# Altium project Air724UG_Reference Design_V1.0(PADS9.5).PrjPcb (part 3 of 3)

## Sheet USB.SchDoc: Air724UG 参考设计
size 594 x 419 mm; DESIGNER: Loukanghua; REV: V1.0
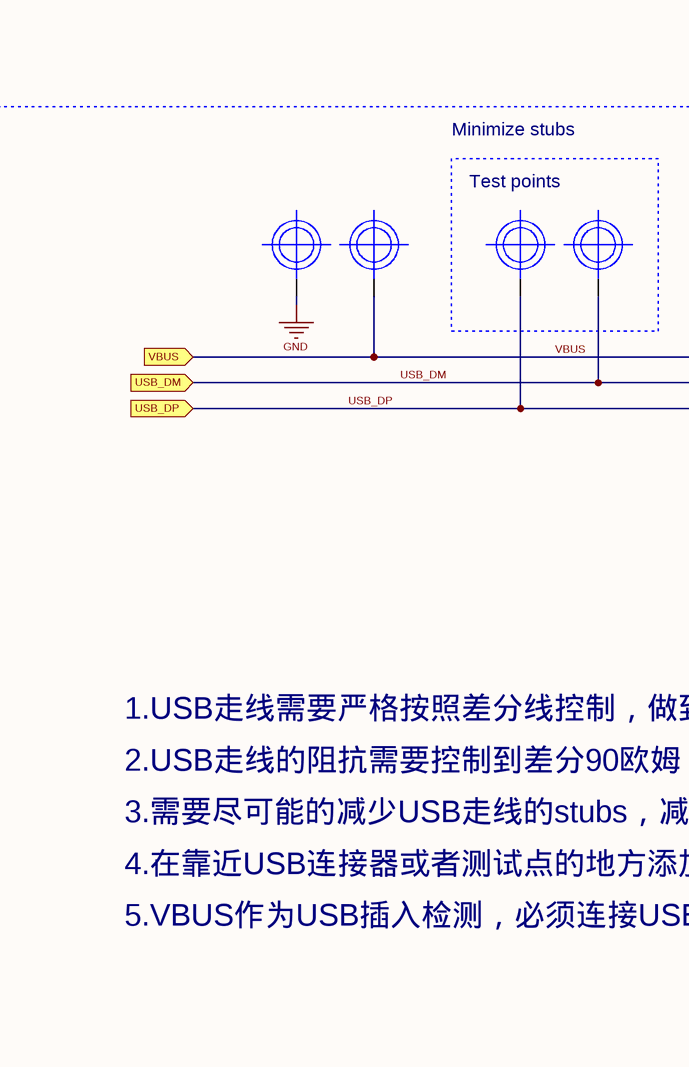
[diagram p42: USB.SchDoc, top left]
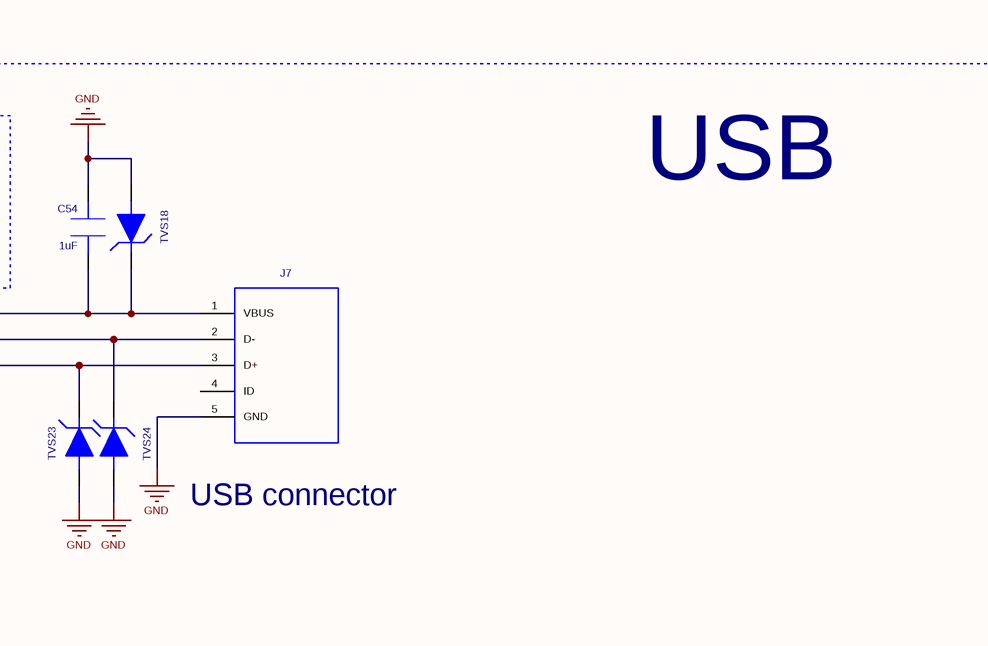
[diagram p43: USB.SchDoc, top middle]
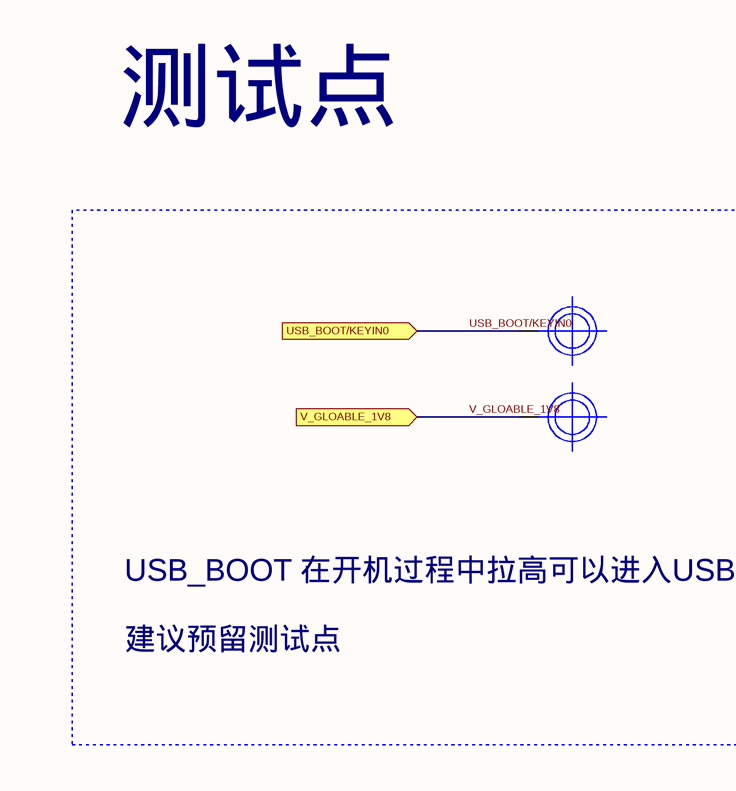
[diagram p44: USB.SchDoc, bottom left]
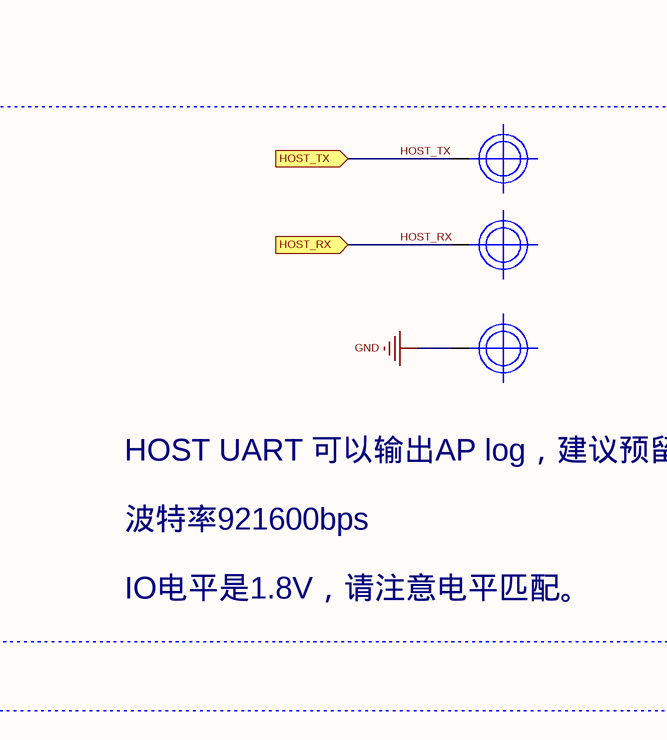
[diagram p45: USB.SchDoc, bottom middle]
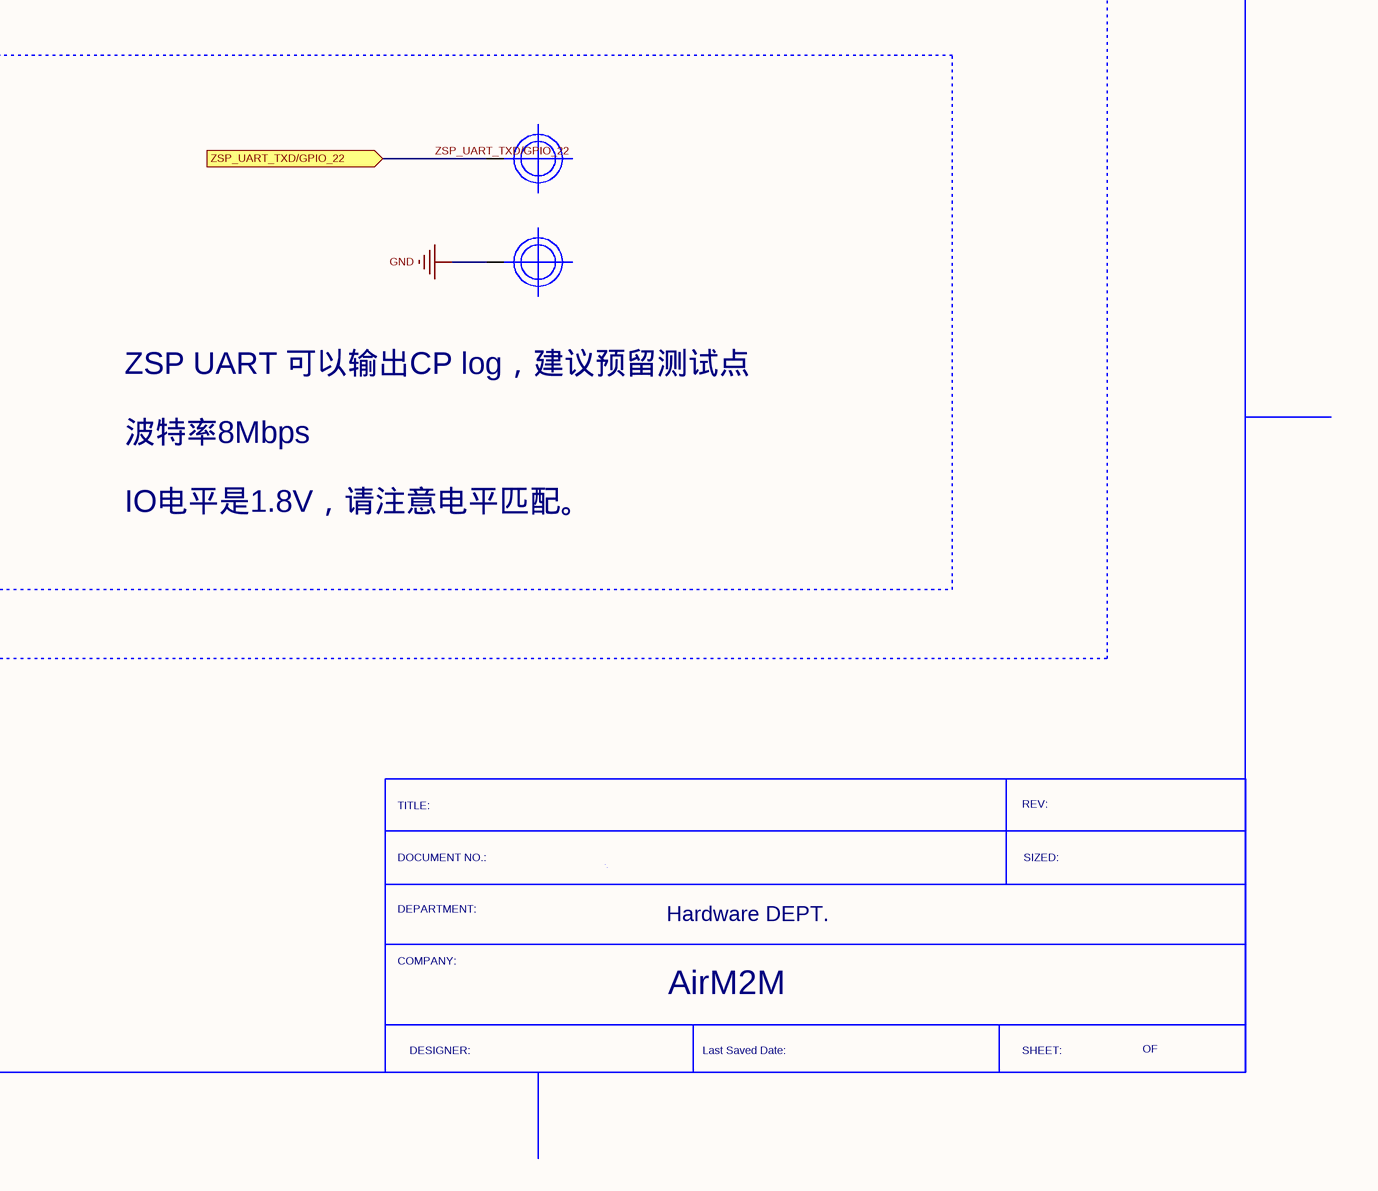
[diagram p46: USB.SchDoc, bottom right]

### Parts
C54  value 1uF  [SC0402]  (hidden comment: CAP-1000PF-0402-X7R)
J7  USB-MICRO-10305060GSAR001  [USB90DEGREE]  (value not drawn)
T1  TESTPOINT  [TP1_5]  (value not drawn)
T2  TESTPOINT  [TP1_5]  (value not drawn)
T3  TESTPOINT  [TP1_5]  (value not drawn)
T4  TESTPOINT  [TP1_5]  (value not drawn)
T5  TESTPOINT  [TP1_5]  (value not drawn)
T6  TESTPOINT  [TP1_5]  (value not drawn)
T7  TESTPOINT  [TP1_5]  (value not drawn)
T8  TESTPOINT  [TP1_5]  (value not drawn)
T9  TESTPOINT  [TP1_5]  (value not drawn)
T10  TESTPOINT  [TP1_5]  (value not drawn)
T11  TESTPOINT  [TP1_5]  (value not drawn)
TVS18  ESD-TVS-ESD9X7.0ST5G  [SOD-923-ESD9X5.0ST5G]  (value not drawn)
TVS23  ESD-TVS-ESD9L5.0T5G  [SOD-923-ESD9L5.0T5G]  (value not drawn)
TVS24  ESD-TVS-ESD9L5.0T5G  [SOD-923-ESD9L5.0T5G]  (value not drawn)

### Blocks framed on the sheet
USB: C54 J7 T1-T4 TVS18 TVS23 TVS24
测试点: T5-T11

### Ports
HOST_RX, HOST_TX, USB_BOOT/KEYIN0, USB_DM, USB_DP, V_GLOABLE_1V8, VBUS, ZSP_UART_TXD/GPIO_22

### Nets
GND: C54.2 J7.5(GND) J7.6(GND) J7.7(GND) T3.1 T9.1 T11.1 TVS18.2 TVS23.2 TVS24.2
HOST_RX: T8.1 ; port HOST_RX
HOST_TX: T7.1 ; port HOST_TX
USB_BOOT/KEYIN0: T5.1 ; port USB_BOOT/KEYIN0
USB_DM: J7.2(D-) T2.1 TVS24.1 ; port USB_DM
USB_DP: J7.3(D+) T1.1 TVS23.1 ; port USB_DP
V_GLOABLE_1V8: T6.1 ; port V_GLOABLE_1V8
VBUS: C54.1 J7.1(VBUS) T4.1 TVS18.1 ; port VBUS
ZSP_UART_TXD/GPIO_22: T10.1 ; port ZSP_UART_TXD/GPIO_22

Not connected (* = marked no-connect by the designer): J7 4(ID)

### Notes on the sheet
- Minimize stubs
- Test points
- USB connector
- 1.USB走线需要严格按照差分线控制，做到平行和等长；
- 2.USB走线的阻抗需要控制到差分90欧姆；
- 3.需要尽可能的减少USB走线的stubs，减少信号反射；USB信号的测试点最好直接放在走线上以减少stub
- 4.在靠近USB连接器或者测试点的地方添加TVS保护管，由于USB的速率较高，需要注意TVS管的选型，保证选用的TVS保护管的寄生电容小于1pF
- 5.VBUS作为USB插入检测，必须连接USB电源或者外接电源，否则USB无法被检测到，VBUS的检测电压要大于3.3V
- HOST UART 可以输出AP log，建议预留测试点
- ZSP UART 可以输出CP log，建议预留测试点
- USB_BOOT 在开机过程中拉高可以进入USB下载模式
- 建议预留测试点
- 波特率921600bps
- 波特率8Mbps
- IO电平是1.8V，请注意电平匹配。
- TITLE:
- REV:
- DEPARTMENT:
- DOCUMENT NO.:
- Hardware DEPT.
- SIZED:
- COMPANY:
- AirM2M
- DESIGNER:
- Last Saved Date:
- SHEET:
- OF

### Library data of the parts
C54 = CAP-1000PF-0402-X7R: CAP CER X7R;1000PF;+/-10%;50V;0402;0.5mm;ROHS; Manufacture 1: MURATA;Yageo;Walsin;Eyang; Manufacture 1 P/N: GRM155R71H102K****;CC0402KRX7R9BB102;0402B102K500CT;C0402X7R102K500N*; Geometry.Height: 0.55mm; Serial Number: 80214750001; Tolerance: +/-10%; PCB DECAL: SC0402
J7 = USB-MICRO-10305060GSAR001: Micro USB 5PIN;插板式;; Manufacture 1: 特图; Geometry.Height: 5.6mm; Manufacture 1 P/N: 10305060GSAR001; PCB DECAL: USB90DEGREE
T1-T11 = TESTPOINT: Geometry.Height: 0.05mm; PCB DECAL: TP1_5
TVS18 = ESD-TVS-ESD9X7.0ST5G: TVS;7.0V;65PF;SOD?923;ROHS; Manufacture 1: ONSEMI; Geometry.Height: 0.43mm; Manufacture 1 P/N: ESD9X7.0ST5G; PCB DECAL: SOD-923-ESD9X5.0ST5G
TVS23 TVS24 = ESD-TVS-ESD9L5.0T5G: TVS;5V;0.5pF;SOD-923;ROHS; Manufacture 1: Onsemi;Will(韦尔)();; Manufacture 1 P/N: ESD9L5.0ST5G;ESD9X5VU-2/TR; Geometry.Height: 0.4mm; Serial Number: 81121000012; PCB DECAL: SOD-923-ESD9L5.0T5G

## Nets that join several sheets
GND: MODULE (22 pins), POWER (21 pins), ADC_RESET (16 pins), AUDIO_1 (24 pins), SIM (32 pins), T-FLASH (12 pins), CAMERA (11 pins), UART (7 pins), USB (10 pins)
V_GLOBAL_1V8: SIM (R13.2), UART (5 pins)
VBAT: MODULE (U6.59 U6.60), POWER (16 pins)
ADC2: MODULE (U6.63), ADC_RESET (C4.2 R1.1 R2.2)
ADC3: MODULE (U6.64), ADC_RESET (C5.2 R3.1 R4.2)
CAM_PWDN: MODULE (U6.78), CAMERA (J22.17)
CAM_REFCLK: MODULE (U6.85), CAMERA (C127.2 R97.2)
CAM_RST: MODULE (U6.84), CAMERA (J22.19)
CAM_SCK: MODULE (U6.86), CAMERA (C126.2 R103.2)
CAM_SI0: MODULE (U6.87), CAMERA (C122.2 R96.2)
CAM_SI1: MODULE (U6.88), CAMERA (C125.2 R95.2)
CAMI2C_SCL1: MODULE (U6.51), CAMERA (J22.20 R94.1)
CAMI2C_SDA1/GPIO_17: MODULE (U6.50), CAMERA (J22.22 R93.1)
EAR_N: MODULE (U6.102), AUDIO_1 (6 pins)
EAR_P: MODULE (U6.101), AUDIO_1 (6 pins)
HEADMIC_BIAS: MODULE (U6.114), AUDIO_1 (5 pins)
HEADMIC_IN_DET: MODULE (U6.105), AUDIO_1 (6 pins)
HEADMIC_P: MODULE (U6.113), AUDIO_1 (R9.1)
HOST_RX: MODULE (U6.6), USB (T8.1)
HOST_TX: MODULE (U6.5), USB (T7.1)
HP_DET: MODULE (U6.106), AUDIO_1 (R57.1)
HP_L: MODULE (U6.112), AUDIO_1 (C64.1)
HP_R: MODULE (U6.103), AUDIO_1 (C65.1)
MIC_N1: MODULE (U6.21), AUDIO_1 (6 pins)
MIC_P1: MODULE (U6.22), AUDIO_1 (6 pins)
MMC1_CLK: MODULE (U6.28), T-FLASH (C131.1 J23.5 R116.1)
MMC1_CMD/GPIO_24: MODULE (U6.27), T-FLASH (C132.1 J23.3 R117.1)
MMC1_DATA0/GPIO_25: MODULE (U6.29), T-FLASH (C130.1 J23.7 R115.1)
MMC1_DATA1/GPIO_26: MODULE (U6.30), T-FLASH (C129.1 J23.8 R114.1)
MMC1_DATA2/GPIO_27: MODULE (U6.25), T-FLASH (C134.1 J23.1 R119.1)
MMC1_DATA3/GPIO_28: MODULE (U6.26), T-FLASH (C133.1 J23.2 R118.1)
PWRKEY: MODULE (U6.68), ADC_RESET (Q1.3 S5.3 S5.4 TVS12.1)
RESET_IN_N: MODULE (U6.1), ADC_RESET (C83.1 Q2.3 S6.3 S6.4)
SIM0_CLK: MODULE (U6.9), SIM (R11.1 R15.1)
SIM0_DATA: MODULE (U6.10), SIM (R12.1 R16.1)
SIM0_DET/GPIO_23: MODULE (U6.8), SIM (J4.7 R13.1)
SIM0_RST: MODULE (U6.11), SIM (R10.1 R14.1)
SIM1_CLK: MODULE (U6.69), SIM (R42.1)
SIM1_DATA: MODULE (U6.70), SIM (R43.1)
SIM1_RST: MODULE (U6.71), SIM (R41.1)
SPI1_CLK/GPIO_9: MODULE (U6.52), UART (J33.2 U4.7)
SPI1_CS/GPIO_10: MODULE (U6.54), UART (J33.3 U4.6)
SPI1_DIN/GPIO_12: MODULE (U6.53), UART (J33.1 U4.8)
SPI1_DOUT/GPIO_11: MODULE (U6.55), UART (J33.4 U4.9)
UART1_CTS/GPIO_18: MODULE (U6.38), UART (U4.5)
UART1_RTS/GPIO_19: MODULE (U6.37), UART (U4.4)
UART1_RXD: MODULE (U6.35), UART (U4.3)
UART1_TXD: MODULE (U6.36), UART (U4.1)
USB_BOOT/KEYIN0: MODULE (U6.66), USB (T5.1)
USB_DM: MODULE (U6.15), USB (J7.2 T2.1 TVS24.1)
USB_DP: MODULE (U6.16), USB (J7.3 T1.1 TVS23.1)
V_GLOABLE_1V8: MODULE (U6.65), USB (T6.1)
V_MMC: MODULE (U6.24), T-FLASH (8 pins)
V_SIM0: MODULE (U6.12), SIM (8 pins)
V_SIM1: MODULE (U6.72), SIM (C88.1 C95.2 J10.4 TVS43.1)
VBUS: MODULE (U6.14), USB (C54.1 J7.1 T4.1 TVS18.1)
ZSP_UART_TXD/GPIO_22: MODULE (U6.7), USB (T10.1)